# EAGLE design TinyArcBuddy1 (EAGLE 7.6.0)
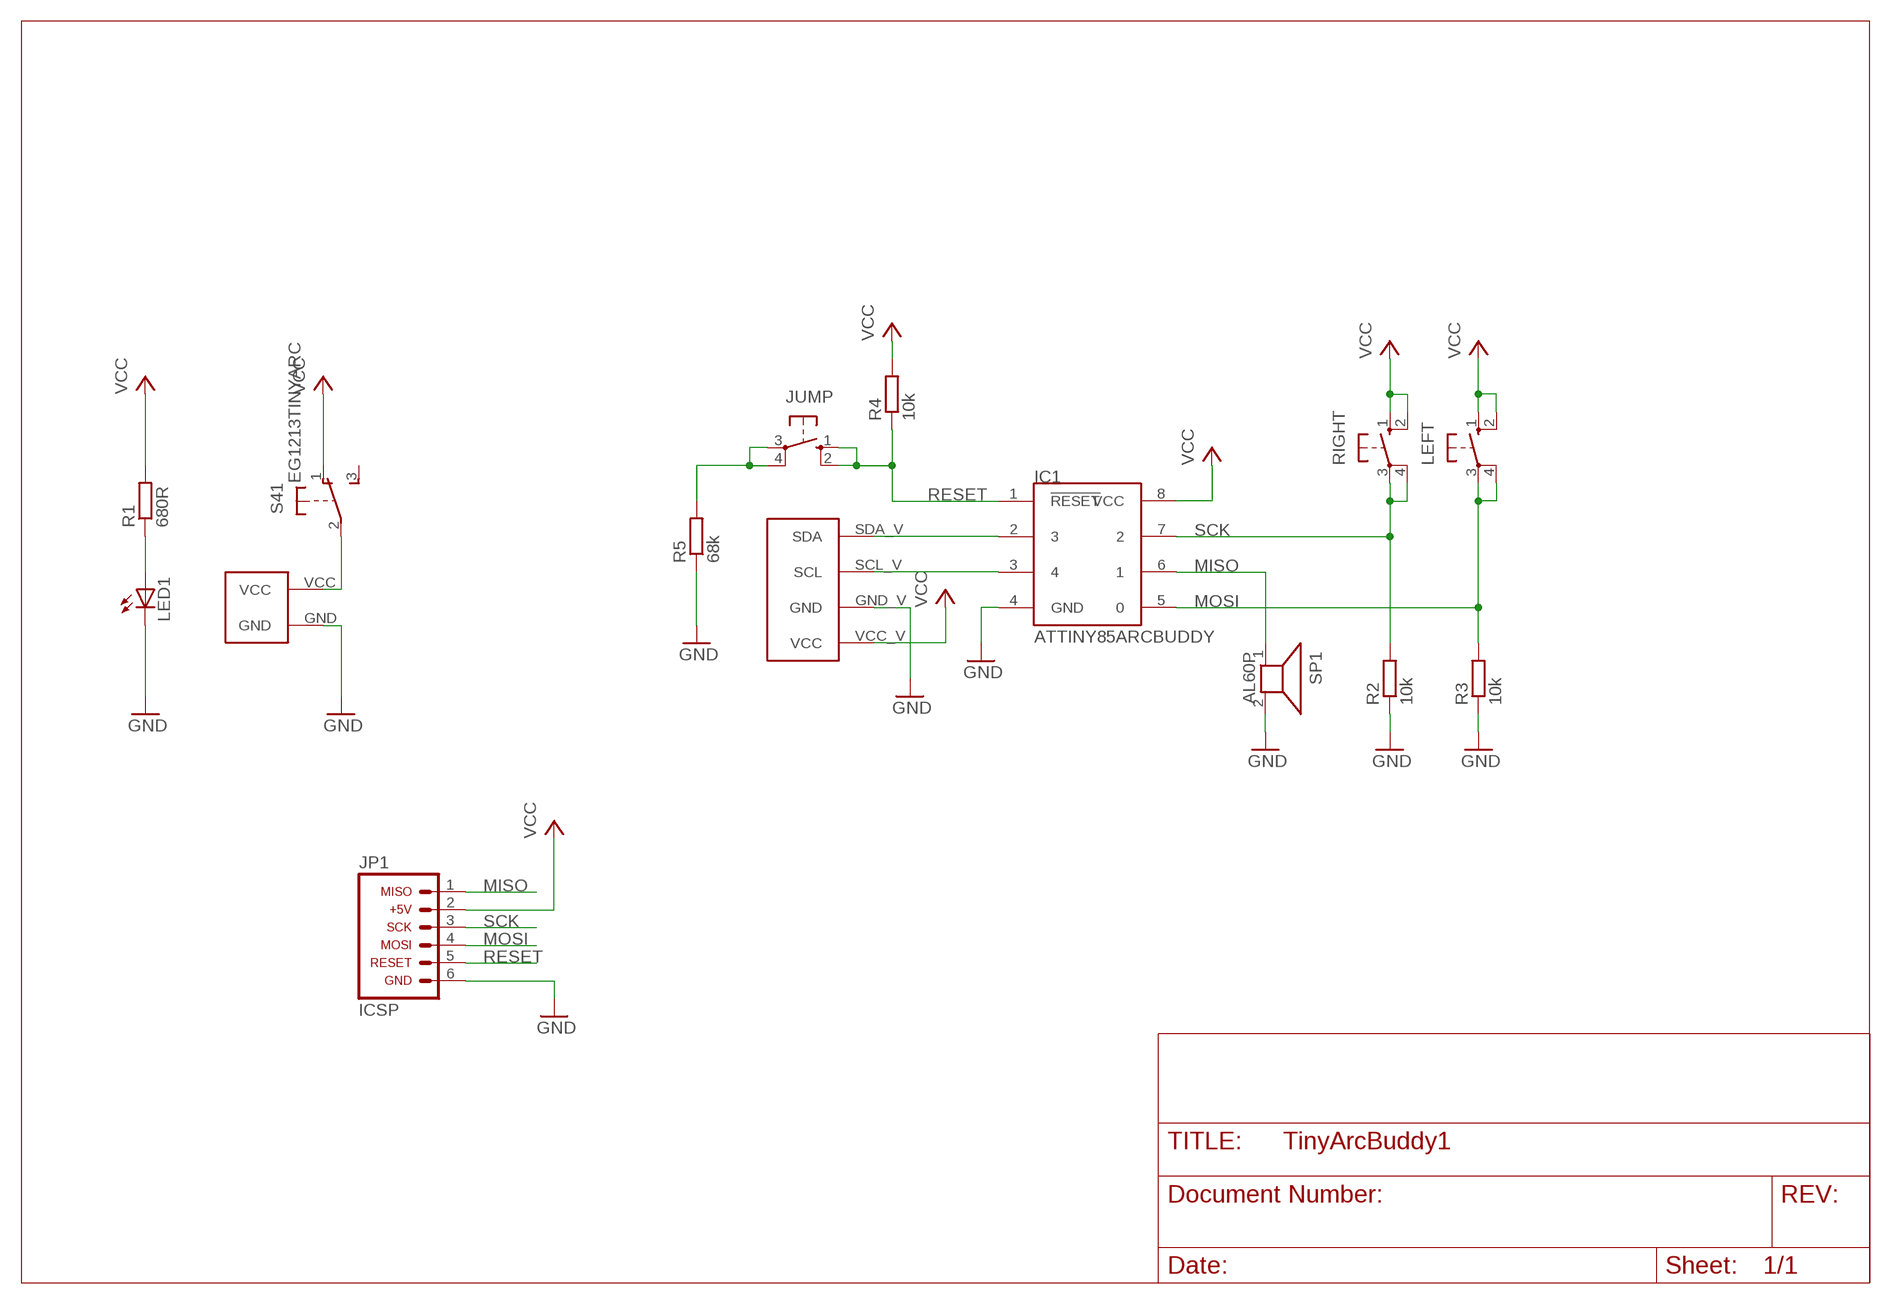
[diagram p0: schematic, sheet 1]

## Parts
IC1  ATTINY85ARCBUDDY  [DIL08]
JP1  ARDUINO_CONN-ICSPTINYARC  [CONN-2X03_TINYARC]
JUMP  10-XX  [B3F-10XX]
LED1  LED3MM  [LED3MM]
LEFT  10-XX  [B3F-10XX]
R1  680R  R-EU_0207/10  [0207/10]
R2  10k  R-EU_0207/10  [0207/10]
R3  10k  R-EU_0207/10  [0207/10]
R4  10k  R-EU_0207/10  [0207/10]
R5  68k  R-EU_0207/10  [0207/10]
RIGHT  10-XX  [B3F-10XX]
S4  EG1213TINYARC  [EG1213_TINYARC]
SP1  AL60P  [AL60P]
U$1  I2C_OLEDTINYARC  [I2C_OLED_PACKAGE_TINYARC]
U$2  CR2032  [CR2032-20MM]

## Nets
GND: IC1.4(GND) JP1.6 LED1.K(C) R2.1 R3.1 R5.1 SP1.2 U$1.GND_V(GND) U$2.GND
MISO: IC1.6 JP1.1 SP1.1
MOSI: IC1.5 JP1.4 LEFT.3(P) LEFT.4(P1) R3.2
N$1: IC1.3 U$1.SCL_V(SCL)
N$2: IC1.2 U$1.SDA_V(SDA)
N$3: S4.2(1:P) U$2.VCC
N$4: LED1.A R1.1
N$8: JUMP.3(P) JUMP.4(P1) R5.2
RESET: IC1.1(!RESET) JP1.5 JUMP.1(S) JUMP.2(S1) R4.1
SCK: IC1.7 JP1.3 R2.2 RIGHT.3(P) RIGHT.4(P1)
VCC: IC1.8(VCC) JP1.2 LEFT.1(S) LEFT.2(S1) R1.2 R4.2 RIGHT.1(S) RIGHT.2(S1) S4.1(1:O) U$1.VCC_V(VCC)
Unconnected: S4.3(1:S) S4.MT1(MT) S4.MT2(MT)

## Library data of the parts
IC1 = Kainduino:ATTINY85
JP1 = Kainduino:ARDUINO_CONN-ICSP: Arduino ICSP I/O Header This is the ICSP I/O header on the Arduino Uno R3. This connector is labeled with the following pin assignments: MISO +5V SCK MOSI RESET GND NOTE: Be sure you install this connector with the correct orientation on your PCB layout. Pin 1 has a square pad to assist with orientation.
JUMP LEFT RIGHT = Kainduino:10-XX: OMRON SWITCH; MPN: B3F-1000; OC_FARNELL: 176432; OC_NEWARK: 36M3542
LED1 = Kainduino:LED: LED OSRAM: - CHIPLED LG R971, LG N971, LY N971, LG Q971, LY Q971, LO R971, LY R971 LH N974, LH R974 LS Q976, LO Q976, LY Q976 LO Q996 - Hyper CHIPLED LW Q18S LB Q993, LB Q99A, LB R99A - SideLED LS A670, LO A670, LY A670, LG A670, LP A670 LB A673, LV A673, LT A673, LW A673 LH A674 LY A675 LS A676, LA A676, LO A676, LY A676, LW A676 LS A679, LY A679, LG A679 - Hyper Micro SIDELED® LS Y876, LA Y876, LO Y876, LY Y876 LT Y87S - SmartLED LW L88C, LW L88S LB L89C, LB L89S, LG L890 LS L89K, LO L89K, LY L89K LS L896, LA L896, LO L896, LY L896 - TOPLED LS T670, LO T670, LY T670, LG T670, LP T670 LSG T670, LSP T670, LSY T670, LOP T670, LYG T670 LG T671, LOG T671, LSG T671 LB T673, LV T673, LT T673, LW T673 LH T674 LS T676, LA T676, LO T676, LY T676, LB T676, LH T676, LSB T676, LW T676 LB T67C, LV T67C, LT T67C, LS T67K, LO T67K, LY T67K, LW E67C LS E67B, LA E67B, LO E67B, LY E67B, LB E67C, LV E67C, LT E67C LW T67C LS T679, LY T679, LG T679 LS T770, LO T770, LY T770, LG T770, LP T770 LB T773, LV T773, LT T773, LW T773 LH T774 LS E675, LA E675, LY E675, LS T675 LS T776, LA T776, LO T776, LY T776, LB T776 LHGB T686 LT T68C, LB T68C - Hyper Mini TOPLED® LB M676 - Mini TOPLED Santana® LG M470 LS M47K, LO M47K, LY M47K Source: http://www.osram.convergy.de LUXEON: - LUMILED® LXK2-PW12-R00, LXK2-PW12-S00, LXK2-PW14-U00, LXK2-PW14-V00 LXK2-PM12-R00, LXK2-PM12-S00, LXK2-PM14-U00 LXK2-PE12-Q00, LXK2-PE12-R00, LXK2-PE12-S00, LXK2-PE14-T00, LXK2-PE14-U00 LXK2-PB12-K00, LXK2-PB12-L00, LXK2-PB12-M00, LXK2-PB14-N00, LXK2-PB14-P00, LXK2-PB14-Q00 LXK2-PR12-L00, LXK2-PR12-M00, LXK2-PR14-Q00, LXK2-PR14-R00 LXK2-PD12-Q00, LXK2-PD12-R00, LXK2-PD12-S00 LXK2-PH12-R00, LXK2-PH12-S00 LXK2-PL12-P00, LXK2-PL12-Q00, LXK2-PL12-R00 Source: www.luxeon.com KINGBRIGHT: KA-3528ASYC Source: www.kingbright.com
R1-R5 = Kainduino:R-EU_: RESISTOR, European symbol
S4 = Kainduino:EG1213: E-Switch right-angle slide SPDT Part #EG1213 http://www.ladyada.net/library/eagle
SP1 = Kainduino:AL60P: SPEAKER Source: Buerklin; OC_FARNELL: unknown; OC_NEWARK: unknown
U$1 = Kainduino:I2C_OLED
U$2 = Kainduino:CR2032

## Board
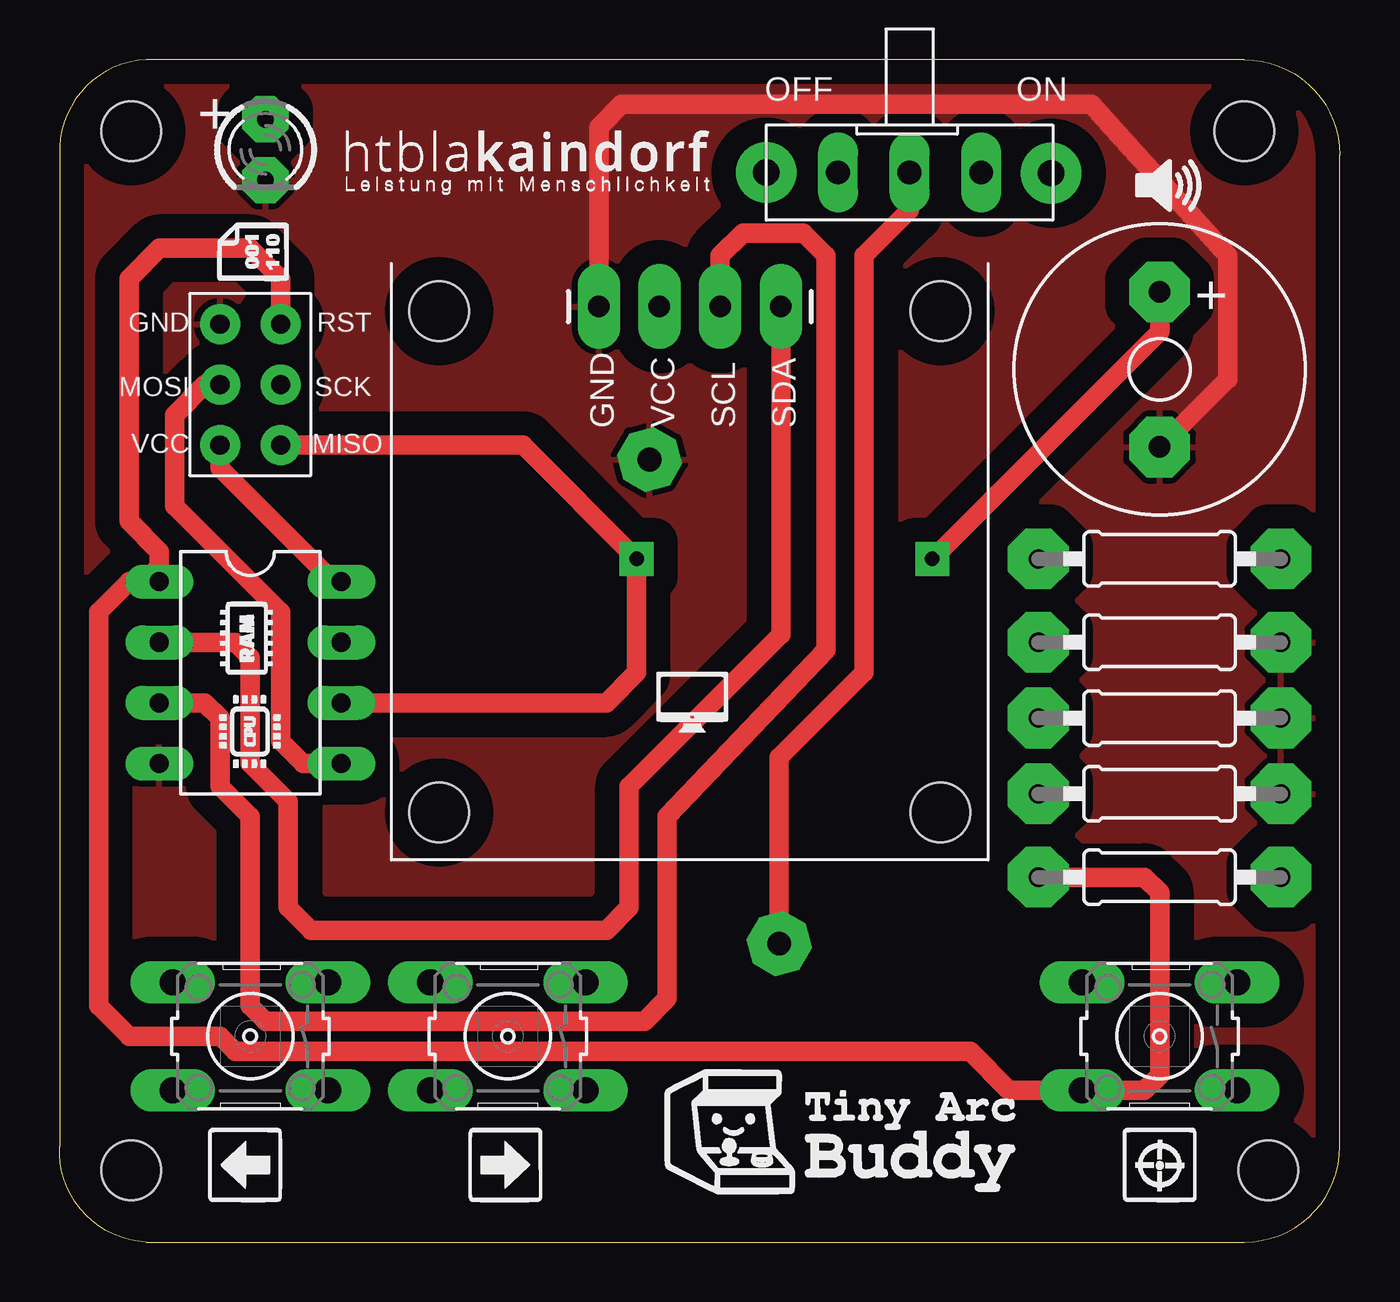
[diagram p1: board, top side]
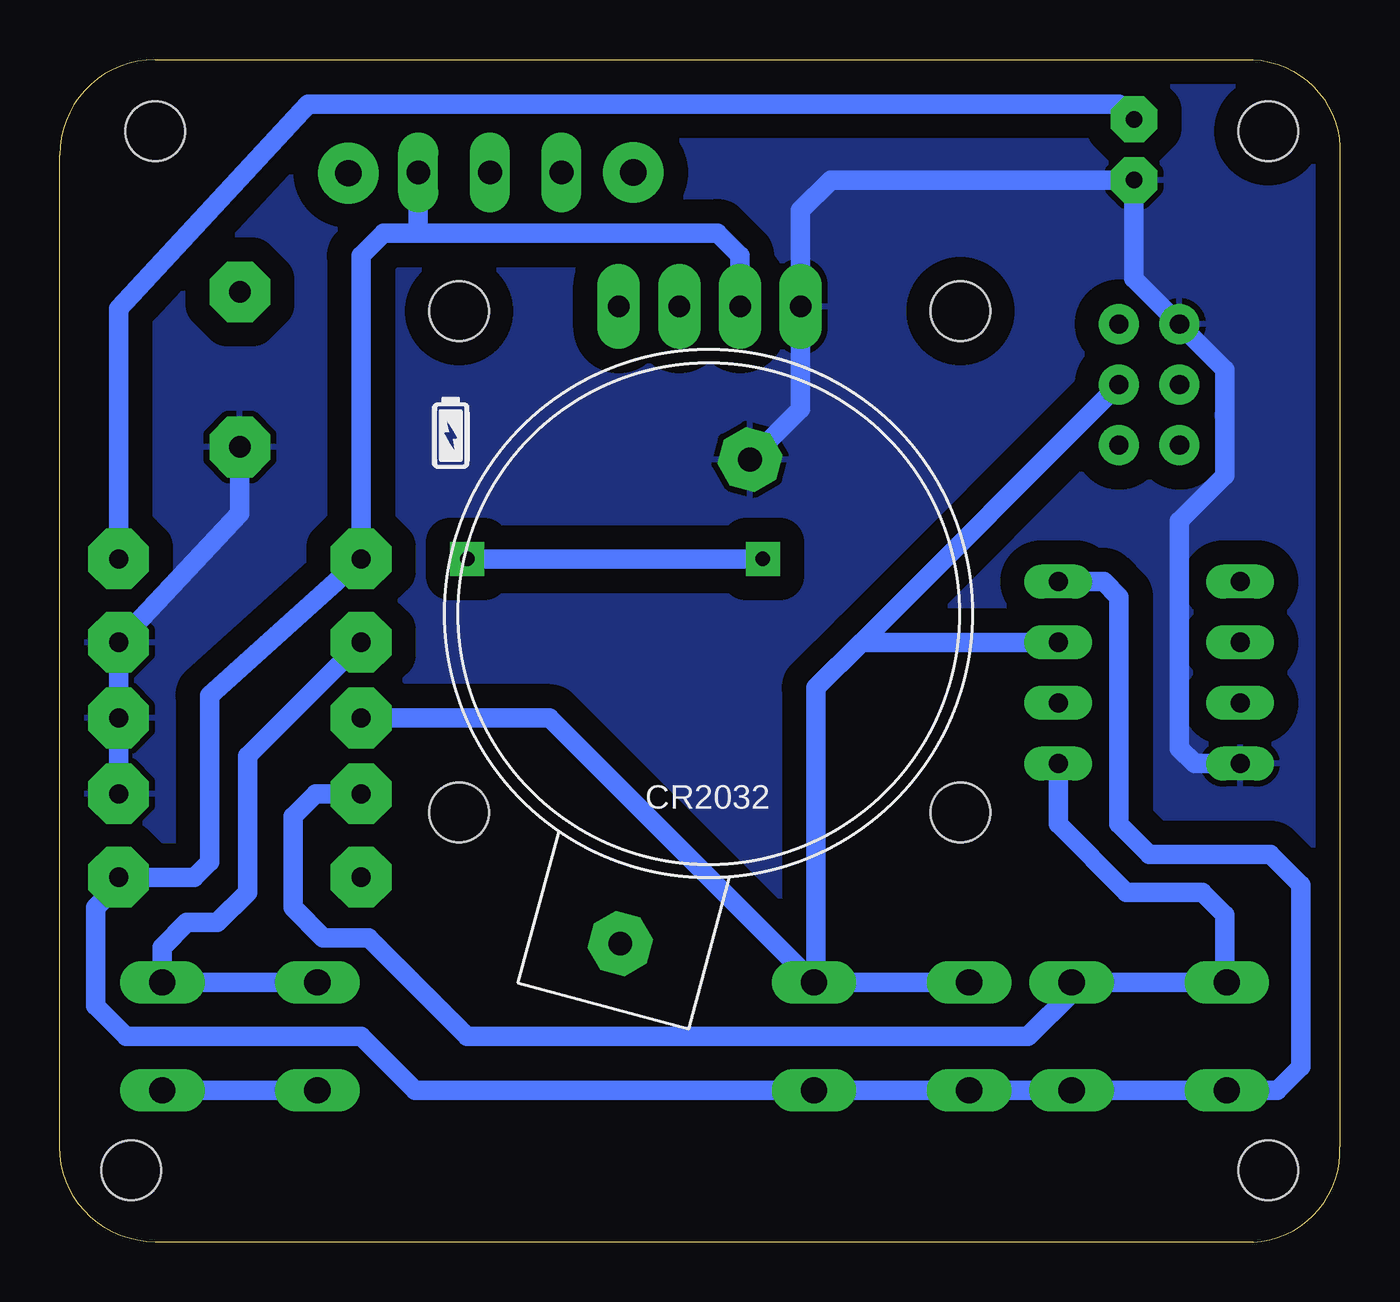
[diagram p2: board, bottom side, seen from below]

Size 53.64 x 49.54 mm. Coordinates in mm from the lower left corner, seen from the top.
Outline: 3.64,0 arc-90 0,4 0,45.54 arc-90 3.64,49.54 49.64,49.54 arc-90 53.64,45.54 53.64,4 arc-90 49.64,0 3.64,0
Copper layers (1*16): Top 0.035mm / dielectric 1.5mm / Bottom 0.035mm
Design rules "default": minimum track width 10mil, minimum drill 24mil, track to track 8mil, track to pad 8mil, pad to pad 8mil, via to via 8mil, smd to smd 8mil, copper to edge 40mil, drill to drill 8mil, minimum pad ring 10mil, minimum via ring 8mil, stop-mask expansion 4mil, vias tented up to drill 0mil, thermal gap 10mil
Holes 2.5 mm at 3,3 50.64,3 49.64,46.54 3,46.54

### Footprints (pad centres in the part's own frame; a part is rotated, then mirrored left to right if it is on the bottom)
DIL08 = drill 0.8 pad 1.422 long: 1 -3.81,-3.81; 2 -1.27,-3.81; 3 1.27,-3.81; 4 3.81,-3.81; 5 3.81,3.81; 6 1.27,3.81; 7 -1.27,3.81; 8 -3.81,3.81
CONN-2X03_TINYARC = drill 0.8 pad 1.676: 1 0,0; 2 2.54,0; 3 0,-2.54; 4 2.54,-2.54; 5 0,-5.08; 6 2.54,-5.08
B3F-10XX = drill 1.1 pad 1.778 long: 1 -3.251,2.261; 2 3.251,2.261; 3 -3.251,-2.261; 4 3.251,-2.261
LED3MM = drill 0.7 pad 1.93 octagon: A -1.27,0; K 1.27,0
0207/10 = drill 0.8 pad 2.54 octagon: 1 -5.08,0; 2 5.08,0
EG1213_TINYARC = drill 1 pad 1.676 long: 1 -3,0; 2 0,0; 3 3,0 | drill 1.1 pad 2.54: MT1 -5.931,0.031; MT2 6.002,0
AL60P = drill 0.9 pad 2.54 octagon: 1 -3.251,0; 2 3.251,0
I2C_OLED_PACKAGE_TINYARC = drill 0.9 pad 1.778 long: GND_V -3.81,-1.81; SCL_V 1.27,-1.81; SDA_V 3.81,-1.81; VCC_V -1.27,-1.81 | hole 2.5: -10.5,-2; 10.5,-2; 10.5,-23; -10.5,-23
CR2032-20MM = drill 1 pad 2.54 octagon: GND 0,6.69; VCC 0,-14.31

### Placement (x,y rotation side)
IC1  7.99,23.86 270 top
JP1  9.26,33.38 180 top
JUMP  46.09,8.62 180 top
LED1  8.62,45.77 270 top
LEFT  7.99,8.62 180 top
R1  46.09,28.62 180 top
R2  46.09,21.95 180 top
R3  46.09,18.78 180 top
R4  46.09,15.29 0 top
R5  46.09,25.13 180 top
RIGHT  18.78,8.62 180 top
S4  35.61,44.81 180 top
SP1  46.09,36.56 270 top
U$1  26.4,41 0 top
U$2  26.44,26.33 345 bottom

### Tracks (layer width: path | path; a pad name or v marks a point on that pad's centre or on a via)
GND
  Top 0.813: U$1.GND_V 22.59,46.72 23.54,47.67 43.23,47.67 48.94,41.32 48.94,36.17 SP1.2
  Bottom 0.813: IC1.4 6.08,20.05 6.72,20.69 6.72,30.21 4.81,32.11 4.81,36.56 JP1.6 8.62,40.37 8.62,44.18 | R3.1 R2.1 R5.1 46.09,30.53 SP1.2 46.09,33.38 | LED1.K 8.62,44.18 | 8.62,44.18 8.94,44.5 21.32,44.5 22.59,43.23 U$1.GND_V 22.59,34.91 U$2.GND
  pour Top (isolate 1.016): 0.05,0.05 53.71,0.05 53.71,49.58 0.05,49.58
  pour Bottom (isolate 1.016): 0.05,0.05 53.71,0.05 53.71,49.58 0.05,49.58
MISO  (via drill 0.6 pad 1.42)
  Top 0.813: SP1.1 46.09,38.15 v36.56,28.62 | JP1.1 19.42,33.38 v24.18,28.62 24.18,23.86 22.91,22.59 IC1.6
  Bottom 0.813: v36.56,28.62 v24.18,28.62
MOSI
  Top 0.813: JP1.4 6.08,35.92 4.81,34.66 4.81,30.85 9.26,26.4 9.26,21 10.21,20.05 IC1.5
  Bottom 0.813: IC1.5 11.8,17.51 8.94,14.65 5.76,14.65 4.81,13.7 4.81,10.96 LEFT.4 LEFT.3 11.24,10.45 13.07,8.62 36.56,8.62 40.69,12.75 42.59,12.75 43.86,14.02 43.86,17.83 42.91,18.78 R3.2
N$1
  Top 0.813: IC1.3 6.08,22.59 6.72,21.95 6.72,19.1 7.99,17.83 7.99,9.89 8.62,9.26 24.5,9.26 25.45,10.21 25.45,17.83 32.12,24.81 32.12,41.32 31.16,42.28 28.62,42.28 27.67,41.32 U$1.SCL_V
N$2
  Top 0.813: IC1.2 7.35,25.13 7.99,24.49 7.99,20.05 9.57,18.46 9.57,14.02 10.53,13.06 22.91,13.06 23.86,14.02 23.86,19.1 30.21,25.45 U$1.SDA_V
N$3
  Top 0.813: S4.2 35.61,43.23 33.7,41.32 33.7,23.86 30.15,20.3 U$2.VCC
N$4
  Bottom 0.813: LED1.A 9.26,47.67 43.23,47.67 51.17,39.1 R1.1
N$8
  Bottom 0.813: R5.2 45.77,20.37 45.77,14.65 47.04,13.38 48.31,13.38 49.34,12.35 JUMP.3 JUMP.4 42.91,10.96
RESET
  Top 0.813: 3.54,27.67 2.91,27.67 1.64,26.4 1.64,9.89 2.91,8.62 6.72,8.62 7.35,7.98 38.15,7.98 39.77,6.36 JUMP.2 45.45,6.36 46.09,6.99 46.09,14.65 45.45,15.29 R4.1 | 3.54,27.67 IC1.1 | 3.54,27.67 4.18,28.31 4.18,28.94 2.91,30.21 2.91,40.37 4.18,41.64 7.99,41.64 9.26,40.37 JP1.5
  Bottom 0.813: JUMP.1 JUMP.2
SCK
  Bottom 0.813: RIGHT.4 RIGHT.3 | IC1.7 20.05,25.13 | 20.05,25.13 21.96,23.22 21.96,10.96 RIGHT.3 | RIGHT.3 33.11,21.95 R2.2 | JP1.3 20.05,25.13
VCC
  Top 0.813: JP1.2 6.72,32.43 11.48,27.67 IC1.8
  Bottom 0.813: IC1.8 9.89,27.67 9.26,27.04 9.26,17.51 7.99,16.24 2.91,16.24 1.64,14.97 1.64,7.35 2.63,6.36 LEFT.2 LEFT.1 RIGHT.2 RIGHT.1 38.75,6.36 41.01,8.62 50.85,8.62 52.12,9.89 52.12,14.02 50.85,15.29 R4.2 47.99,15.29 47.36,15.92 47.36,22.91 R1.2 41.01,41.32 40.05,42.28 38.47,42.28 | U$1.VCC_V 25.13,41.32 26.08,42.28 38.47,42.28 | S4.1 38.61,42.42 38.47,42.28

### Text on the board
tPlace: OFF | ON | +
bPlace: CR2032